# EAGLE design PDM 2021 (EAGLE 9.6.2)
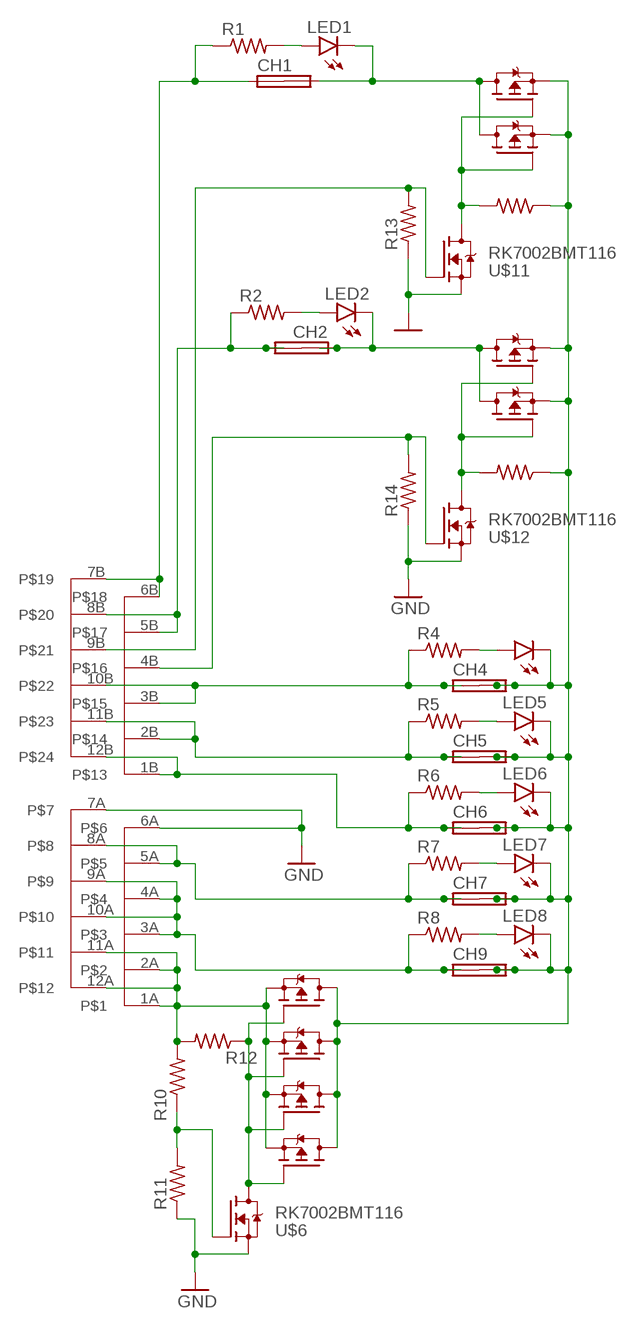
[diagram p0: schematic, sheet 1]

## Parts
CH1  3568FUSEHOLDER  [3568]
CH2  3568FUSEHOLDER  [3568]
CH4  3568FUSEHOLDER  [3568]
CH5  3568FUSEHOLDER  [3568]
CH6  3568FUSEHOLDER  [3568]
CH7  3568FUSEHOLDER  [3568]
CH9  3568FUSEHOLDER  [3568]
LED1  LEDCHIP-LED0805  [CHIP-LED0805]
LED2  LEDCHIP-LED0805  [CHIP-LED0805]
LED4  LEDCHIP-LED0805  [CHIP-LED0805]
LED5  LEDCHIP-LED0805  [CHIP-LED0805]
LED6  LEDCHIP-LED0805  [CHIP-LED0805]
LED7  LEDCHIP-LED0805  [CHIP-LED0805]
LED8  LEDCHIP-LED0805  [CHIP-LED0805]
R1  R-US_R0805  [R0805]
R2  R-US_R0805  [R0805]
R4  R-US_R0805  [R0805]
R5  R-US_R0805  [R0805]
R6  R-US_R0805  [R0805]
R7  R-US_R0805  [R0805]
R8  R-US_R0805  [R0805]
R10  R-US_R0805  [R0805]
R11  R-US_R0805  [R0805]
R12  R-US_R0805  [R0805]
R13  R-US_R0805  [R0805]
R14  R-US_R0805  [R0805]
R15  R-US_R0805  [R0805]
R16  R-US_R0805  [R0805]
U$1  _CUSTOM_111_CUSTOM_SQJ407EP-T1_GE3  [_CUSTOM_111_CUSTOM_TRANS_SIRA90DP-T1-GE3]
U$2  _CUSTOM_111_CUSTOM_SQJ407EP-T1_GE3  [_CUSTOM_111_CUSTOM_TRANS_SIRA90DP-T1-GE3]
U$3  _CUSTOM_111_CUSTOM_SQJ407EP-T1_GE3  [_CUSTOM_111_CUSTOM_TRANS_SIRA90DP-T1-GE3]
U$4  DTM1312PA12BR008  [DE_12X2_PIN_HEADER]
U$5  _CUSTOM_111_CUSTOM_SQJ407EP-T1_GE3  [_CUSTOM_111_CUSTOM_TRANS_SIRA90DP-T1-GE3]
U$6  RK7002BMT116  [SOT23]
U$7  _CUSTOM_111_CUSTOM_SQJ407EP-T1_GE3  [_CUSTOM_111_CUSTOM_TRANS_SIRA90DP-T1-GE3]
U$8  _CUSTOM_111_CUSTOM_SQJ407EP-T1_GE3  [_CUSTOM_111_CUSTOM_TRANS_SIRA90DP-T1-GE3]
U$9  _CUSTOM_111_CUSTOM_SQJ407EP-T1_GE3  [_CUSTOM_111_CUSTOM_TRANS_SIRA90DP-T1-GE3]
U$10  _CUSTOM_111_CUSTOM_SQJ407EP-T1_GE3  [_CUSTOM_111_CUSTOM_TRANS_SIRA90DP-T1-GE3]
U$11  RK7002BMT116  [SOT23]
U$12  RK7002BMT116  [SOT23]

## Nets
CH2: CH2.L1(1A) CH2.L2(1B) R2.1 U$4.5B U$4.8B
CH4: CH4.L1(1A) CH4.L2(1B) R4.1 U$4.3B U$4.10B
CH5: CH5.L1(1A) CH5.L2(1B) R5.1 U$4.2B U$4.11B
CH6: CH6.L1(1A) CH6.L2(1B) R6.1 U$4.1B U$4.12B
CH8: CH7.L1(1A) CH7.L2(1B) R7.1 U$4.5A U$4.8A
CH10: CH9.L1(1A) CH9.L2(1B) R8.1 U$4.3A U$4.4A U$4.9A U$4.10A
CH11: CH2.R1(2A) CH2.R2(2B) LED2.C U$9.5(D) U$10.5(D)
GND: R11.1 R13.1 R14.1 U$4.6A U$4.7A U$6.2(S) U$11.2(S) U$12.2(S)
N$1: CH4.R1(2A) CH4.R2(2B) CH5.R1(2A) CH5.R2(2B) CH6.R1(2A) CH6.R2(2B) CH7.R1(2A) CH7.R2(2B) CH9.R1(2A) CH9.R2(2B) LED4.C LED5.C LED6.C LED7.C LED8.C R15.1 R16.1 U$1.5(D) U$2.5(D) U$3.5(D) U$5.5(D) U$7.1(S) U$7.2(S) U$7.3(S) U$8.1(S) U$8.2(S) U$8.3(S) U$9.1(S) U$9.2(S) U$9.3(S) U$10.1(S) U$10.2(S) U$10.3(S)
N$2: LED8.A R8.2
N$3: LED7.A R7.2
N$4: LED6.A R6.2
N$5: LED5.A R5.2
N$6: LED4.A R4.2
N$7: CH1.L1(1A) R1.1 U$4.6B U$4.7B
N$8: LED2.A R2.2
N$9: CH1.R1(2A) LED1.C U$7.5(D) U$8.5(D)
N$10: R10.1 R11.2 U$6.1(G)
N$11: R12.1 U$1.4(G) U$2.4(G) U$3.4(G) U$5.4(G) U$6.3(D)
N$13: R16.2 U$7.4(G) U$8.4(G) U$11.3(D)
N$14: R13.2 U$4.9B U$11.1(G)
N$16: R10.2 R12.2 U$1.1(S) U$1.2(S) U$1.3(S) U$2.1(S) U$2.2(S) U$2.3(S) U$3.1(S) U$3.2(S) U$3.3(S) U$4.1A U$4.2A U$4.11A U$4.12A U$5.1(S) U$5.2(S) U$5.3(S)
N$17: R15.2 U$9.4(G) U$10.4(G) U$12.3(D)
N$18: LED1.A R1.2
N$19: R14.2 U$4.4B U$12.1(G)
Unconnected: CH1.L2(1B) CH1.R2(2B)

## Library data of the parts
CH1 CH2 CH4-CH7 CH9 = ACC-MB-R0:3568FUSEHOLDER: 3568 20AMP 500VAC
LED1 LED2 LED4-LED8 = led:LED: LED OSRAM: - CHIPLED LG R971, LG N971, LY N971, LG Q971, LY Q971, LO R971, LY R971 LH N974, LH R974 LS Q976, LO Q976, LY Q976 LO Q996 - Hyper CHIPLED LW Q18S LB Q993, LB Q99A, LB R99A - SideLED LS A670, LO A670, LY A670, LG A670, LP A670 LB A673, LV A673, LT A673, LW A673 LH A674 LY A675 LS A676, LA A676, LO A676, LY A676, LW A676 LS A679, LY A679, LG A679 - Hyper Micro SIDELED® LS Y876, LA Y876, LO Y876, LY Y876 LT Y87S - SmartLED LW L88C, LW L88S LB L89C, LB L89S, LG L890 LS L89K, LO L89K, LY L89K LS L896, LA L896, LO L896, LY L896 - TOPLED LS T670, LO T670, LY T670, LG T670, LP T670 LSG T670, LSP T670, LSY T670, LOP T670, LYG T670 LG T671, LOG T671, LSG T671 LB T673, LV T673, LT T673, LW T673 LH T674 LS T676, LA T676, LO T676, LY T676, LB T676, LH T676, LSB T676, LW T676 LB T67C, LV T67C, LT T67C, LS T67K, LO T67K, LY T67K, LW E67C LS E67B, LA E67B, LO E67B, LY E67B, LB E67C, LV E67C, LT E67C LW T67C LS T679, LY T679, LG T679 LS T770, LO T770, LY T770, LG T770, LP T770 LB T773, LV T773, LT T773, LW T773 LH T774 LS E675, LA E675, LY E675, LS T675 LS T776, LA T776, LO T776, LY T776, LB T776 LHGB T686 LT T68C, LB T68C - Hyper Mini TOPLED® LB M676 - Mini TOPLED Santana® LG M470 LS M47K, LO M47K, LY M47K Source: http://www.osram.convergy.de LUXEON: - LUMILED® LXK2-PW12-R00, LXK2-PW12-S00, LXK2-PW14-U00, LXK2-PW14-V00 LXK2-PM12-R00, LXK2-PM12-S00, LXK2-PM14-U00 LXK2-PE12-Q00, LXK2-PE12-R00, LXK2-PE12-S00, LXK2-PE14-T00, LXK2-PE14-U00 LXK2-PB12-K00, LXK2-PB12-L00, LXK2-PB12-M00, LXK2-PB14-N00, LXK2-PB14-P00, LXK2-PB14-Q00 LXK2-PR12-L00, LXK2-PR12-M00, LXK2-PR14-Q00, LXK2-PR14-R00 LXK2-PD12-Q00, LXK2-PD12-R00, LXK2-PD12-S00 LXK2-PH12-R00, LXK2-PH12-S00 LXK2-PL12-P00, LXK2-PL12-Q00, LXK2-PL12-R00 Source: www.luxeon.com KINGBRIGHT: KA-3528ASYC Source: www.kingbright.com
R1 R2 R4-R8 R10-R16 = rcl:R-US_: RESISTOR, American symbol; SPICEPREFIX: R
U$1-U$3 U$5 U$7-U$10 = ACC-MB-R0:_CUSTOM_111_CUSTOM_SQJ407EP-T1_GE3
U$4 = CUSTOM_PARTS:DTM1312PA12BR008
U$6 U$11 U$12 = ACC-MB-R0:RK7002BMT116

## Net classes
0 default: width 0.3 mm, drill 0.3 mm, clearance 0.3 mm

## Board
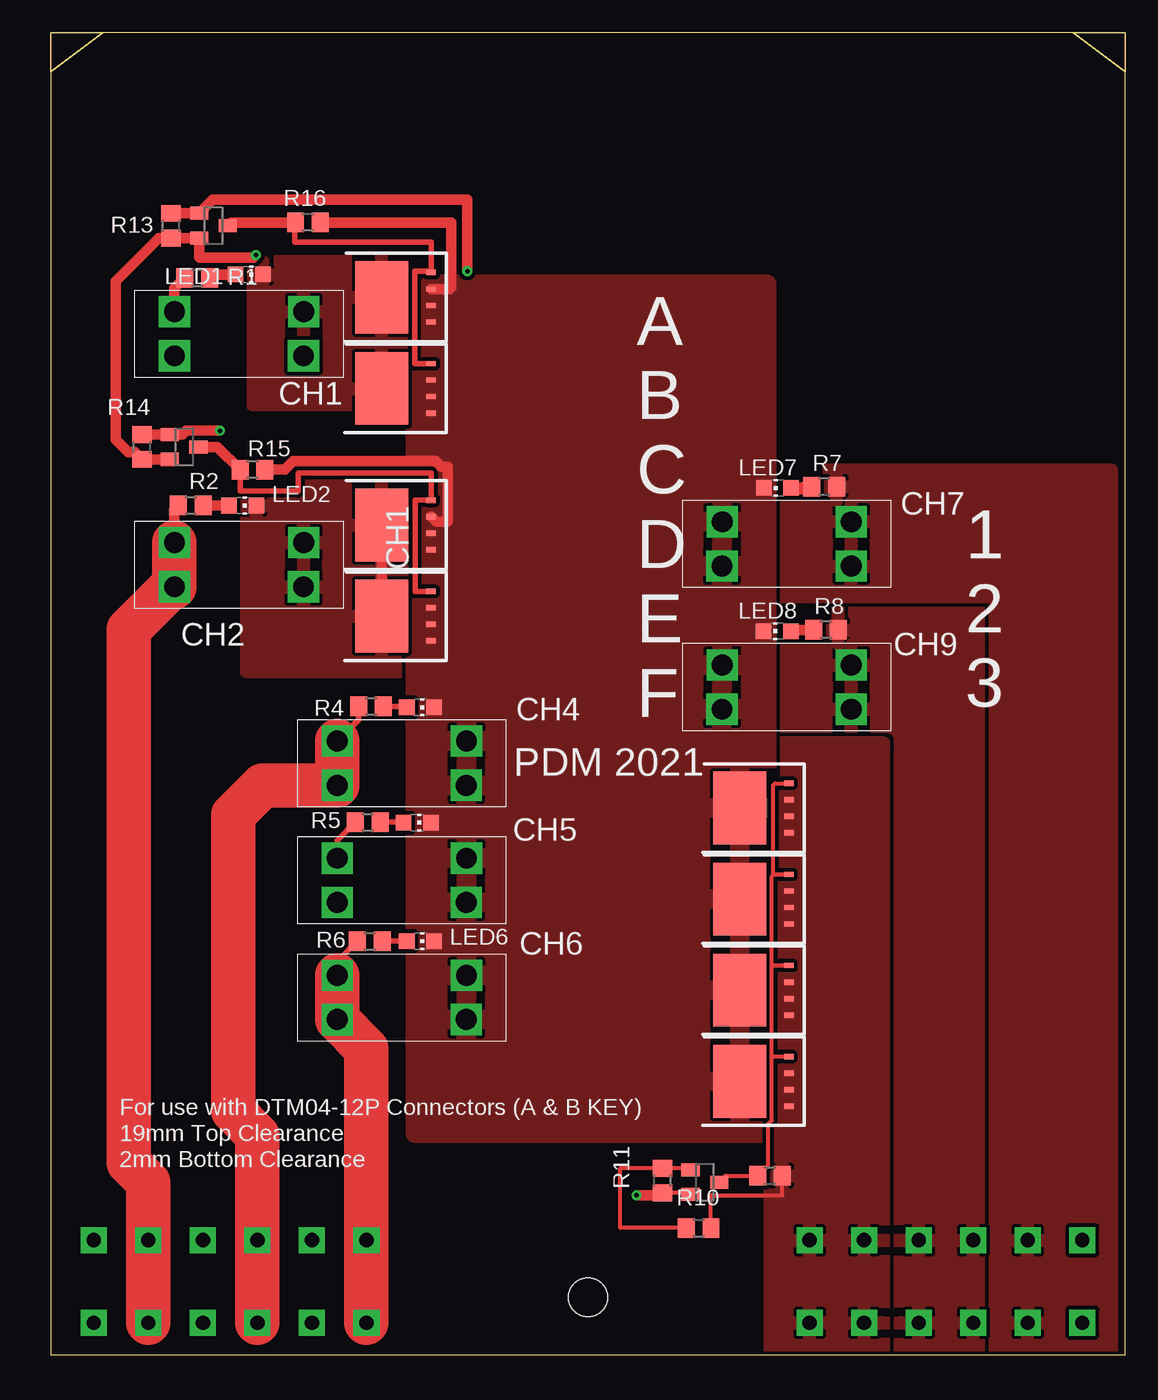
[diagram p1: board, top side]
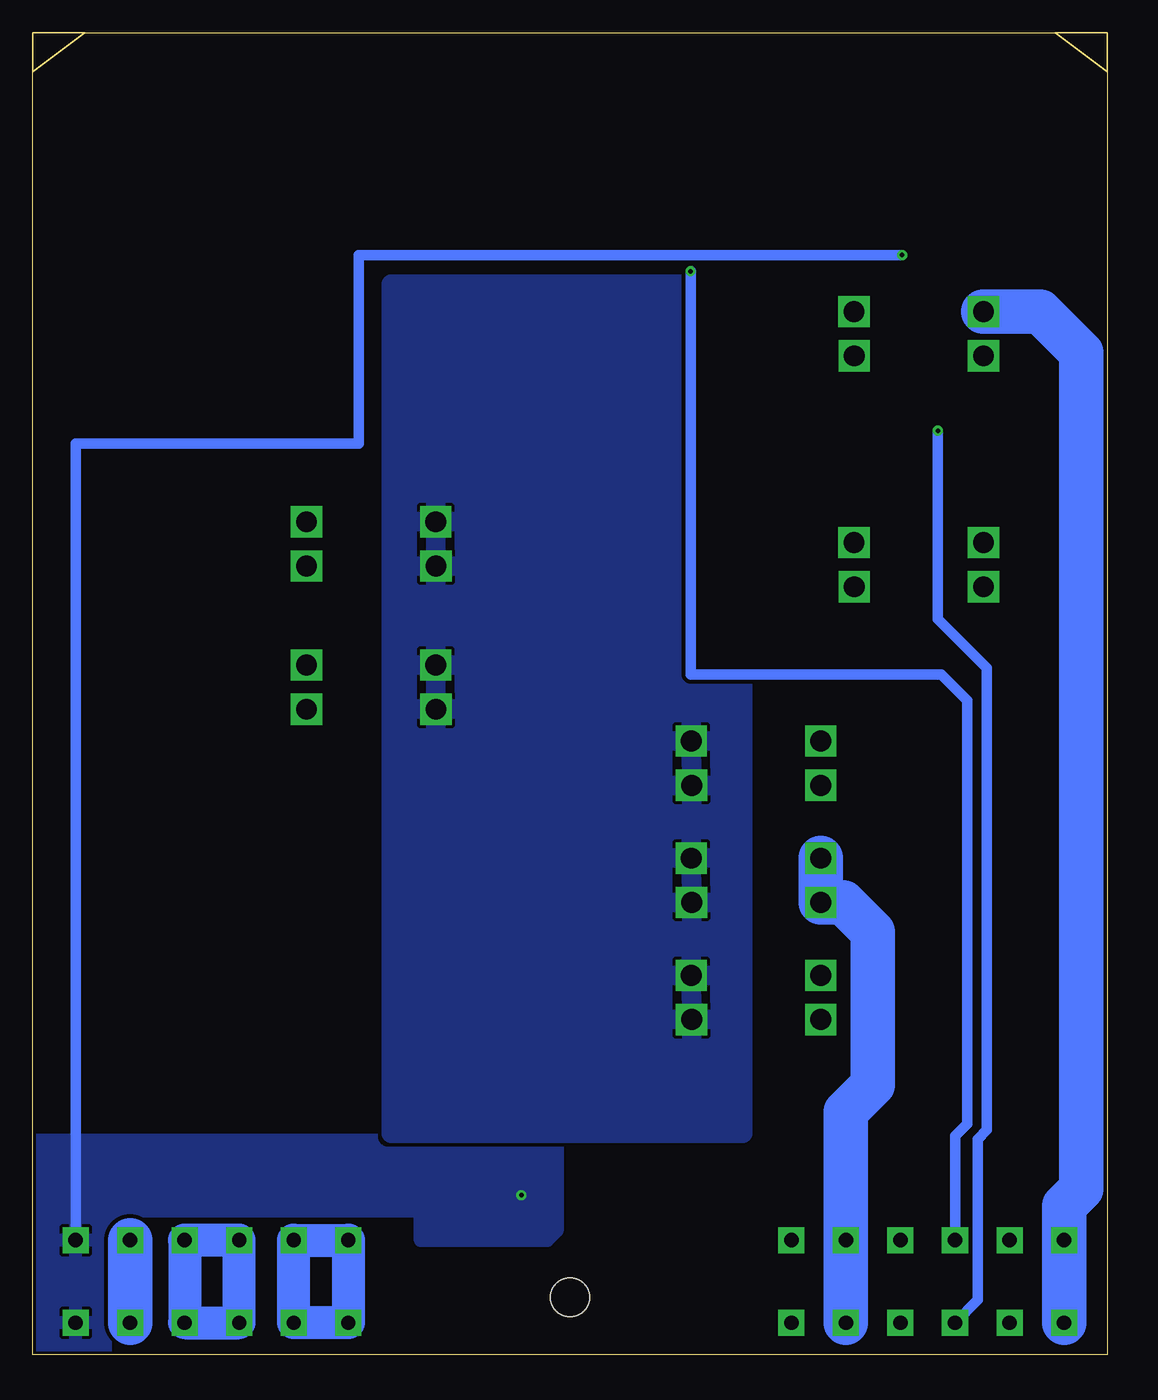
[diagram p2: board, bottom side, seen from below]

Size 82.55 x 101.6 mm. Coordinates in mm from the lower left corner, seen from the top.
Outline: 0,0 82.55,0 82.55,101.6 0,101.6 0,0
Copper layers (1*16): Top 0.035mm / dielectric 1.5mm / Bottom 0.035mm
Design rules "default *": minimum track width 6mil, minimum drill 0.35mm, track to track 6mil, track to pad 6mil, pad to pad 6mil, via to via 6mil, smd to smd 0mil, copper to edge 10mil, drill to drill 6mil, minimum pad ring 10mil, minimum via ring 8mil, stop-mask expansion 4mil, vias tented up to drill 0mil, thermal gap 10mil
Milling: area 0,98.6 to 4,101.6; area 78.5,98.6 to 82.5,101.6

### Footprints (pad centres in the part's own frame; a part is rotated, then mirrored left to right if it is on the bottom)
3568 = drill 1.6 square: L1 0,3.4; L2 0,0; R1 9.94,3.4; R2 9.92,0
CHIP-LED0805 = smd 1.2 x 1.2: A 0,-1.05; C 0,1.05
R0805 = smd 1.3 x 1.5: 1 -0.95,0; 2 0.95,0
_CUSTOM_111_CUSTOM_TRANS_SIRA90DP-T1-GE3 = smd 0.41 x 0.72: 1 -1.905,-2.715; 2 -0.635,-2.715; 3 0.635,-2.715; 4 1.905,-2.715 | smd 5.588 x 4.064: 5 0,1.08
DE_12X2_PIN_HEADER = drill 1.1 pad 2 square: 1A 17.02,4.39; 1B -17.02,-1.96; 2A 21.21,4.39; 2B -21.21,-1.96; 3A 25.4,4.39; 3B -25.4,-1.96; 4A 29.59,4.39; 4B -29.59,-1.96; 5A 33.78,4.39; 5B -33.78,-1.96; 6A 37.97,4.39; 6B -37.97,-1.96; 7A 37.97,-1.96; 7B -37.97,4.39; 8A 33.78,-1.96; 8B -33.78,4.39; 9A 29.59,-1.96; 9B -29.59,4.39; 10A 25.4,-1.96; 10B -25.4,4.39; 11A 21.21,-1.96; 11B -21.21,4.39; 12A 17.02,-1.96; 12B -17.02,4.39 | hole 3: 0,0
SOT23 = smd 1 x 1.4: 1 -0.95,-1.1; 2 0.95,-1.1; 3 0,1.1

### Placement (x,y rotation side)
CH1  9.5,76.75 0 top
CH2  9.5,59 0 top
CH4  22,43.75 0 top
CH5  22,34.75 0 top
CH6  22,25.75 0 top
CH7  61.5,64 180 top
CH9  61.5,53 180 top
LED1  15.25,83 270 top
LED2  14.75,65.25 270 top
LED4  28.4,49.74 270 top
LED5  28.15,40.88 270 top
LED6  28.4,31.77 270 top
LED7  55.83,66.6 90 top
LED8  55.81,55.6 90 top
R1  11.25,82.75 0 top
R2  10.75,65.25 0 top
R4  24.6,49.82 0 top
R5  24.35,40.93 0 top
R6  24.5,31.78 0 top
R7  59.42,66.7 180 top
R8  59.56,55.7 180 top
R10  49.77,9.73 0 top
R11  46.98,13.37 90 top
R12  55.25,13.75 0 top
R13  9.25,86.75 90 top
R14  7,69.75 90 top
R15  15.5,68 180 top
R16  19.75,87 180 top
U$1  54,28 90 top
U$2  54,35 90 top
U$3  54,21 90 top
U$4  41.27,4.41 0 top
U$5  54,42 90 top
U$6  50.25,13.25 270 top
U$7  26.5,74.25 90 top
U$8  26.5,81.25 90 top
U$9  26.5,63.75 90 top
U$10  26.5,56.75 90 top
U$11  12.5,86.75 270 top
U$12  10.25,69.75 270 top

### Tracks (layer width: path | path; a pad name or v marks a point on that pad's centre or on a via)
CH2
  Top 0.813: CH2.L1 9.5,64.95 R2.1
  Top 3.4: U$4.5B U$4.8B 7.5,13.23 6,14.73 6,55.73 9.27,59 CH2.L2 CH2.L1
CH4
  Top 0.406: CH4.L1 23.65,48.8 R4.1
  Top 3.4: U$4.3B U$4.10B 15.88,16.86 14,18.73 14,41.48 16.27,43.75 CH4.L2 CH4.L1
CH5
  Top 0.406: CH5.L1 22,39.53 R5.1
  Bottom 3.4: U$4.2B U$4.11B 20.07,18.66 18,20.73 18,32.48 20.27,34.75 CH5.L2 CH5.L1
CH6
  Top 0.406: CH6.L1 22,30.23 R6.1
  Top 3.4: U$4.1B U$4.12B 24.25,23.5 CH6.L2 CH6.L1
CH8
  Bottom 3.4: U$4.8A U$4.5A
  pour Top (rank 2): 55.25,67.99 55.25,58.75 55.75,58.25 72.5,58.25 72.5,-2.5 81.5,-2.5 81.5,67.99
CH10
  Bottom 2.54: U$4.3A U$4.4A U$4.9A U$4.10A U$4.3A
  pour Top (rank 3): 55.5,57.75 55.5,47.5 65.25,47.5 64.25,-2.5 72.75,-2.5 71.75,57.75
CH11
  Top 0.813: U$9.5 U$10.5
  pour Top (rank 2): 15,67.75 15,52.5 31,52.5 31,67.75
GND  (via drill 0.35)
  Top 0.3: U$6.2 49.03,12.42 R11.1
  Top 0.813: R11.1 46.81,12.25 v45,12.25 | U$12.2 R14.1 6.46,69.34 5.96,69.34 5,70.3 5,82.5 8.3,85.8 R13.1 U$11.2 11.4,84.35 11.44,84.31 15.56,84.31 v15.75,84.5
  Bottom 0.813: v15.75,84.5 57.5,84.5 57.5,70 79.25,70 U$4.6A
  pour Bottom (rank 2): 42.25,16.5 42.25,9.5 43,8.75 52.75,8.75 52.75,11 76.5,11 76.5,-2.5 82.75,-2.5 82.75,16.5
N$1
  Top 0.813: U$8.3 30.64,81.89 30.75,82 30.75,87 R16.1 | R15.1 17.96,68 18.62,68.66 29.59,68.66 30,68.25 30.5,68.25 30.5,64 29.6,64 U$9.3
  pour Top: 28,82.25 28,17 55,17 55,82.25
  pour Bottom: 28,82.25 28,17 55,17 55,82.25
N$2
  Top 0.813: LED8.A 56.96,55.7 R8.2
N$3
  Top 0.813: 57.79,66.56 R7.2
  Top 1: LED7.A 57.79,66.56
N$4
  Top 0.406: R6.2 LED6.A
N$5
  Top 0.406: R5.2 27.05,40.93 LED5.A
N$6
  Top 0.406: R4.2 27.27,49.82 LED4.A
N$7
  Top 0.813: CH1.L1 9.5,81.95 R1.1
  Bottom 3.4: U$4.6B U$4.7B 3.31,11.43 2,12.73 2,77 5.15,80.15 CH1.L1
N$8
  Top 0.813: R2.2 LED2.A
N$9
  pour Top (rank 2): 15.5,84 15.5,73 31,73 31,84
N$10
  Top 0.3: U$6.1 49.03,14.32 R11.2 43.75,14.32 43.75,9.75 43.77,9.73 R10.1
N$11
  Top 0.3: U$6.3 51.85,13.75 R12.1 55.1,14.55 55.1,17.72 55.4,18.02 55.4,22.84 | U$3.4 55.47,22.91 55.4,22.84 | 55.4,22.84 55.4,29.75 | 55.4,29.75 55.56,29.91 U$1.4 55.4,29.91 | 55.4,29.75 55.4,29.91 | 55.4,29.91 55.4,36.75 55.56,36.91 U$2.4 55.5,36.91 55.5,43.75 55.66,43.91 U$5.4
N$13
  Top 0.406: U$7.4 27.95,76.16 27.95,83.25 29.12,83.25 U$8.4 29.21,85.5 18.75,85.5 18.75,86.95
  Top 0.813: U$11.3 13.85,87 R16.2 18.75,86.95
N$14  (via drill 0.35)
  Top 0.813: R13.2 U$11.1 12.45,88.75 32,88.75 v32,83.25
  Bottom 0.813: U$4.9B 11.69,16.82 10.75,17.75 10.75,50.25 12.75,52.25 32,52.25 v32,83.25
N$16
  Top 0.3: R10.2 50.72,12.23 50.74,12.25 56.2,12.25 R12.2
  Bottom 2.54: U$4.1A U$4.12A U$4.11A U$4.2A U$4.1A
  pour Top (rank 2): 55.25,47 55.25,-2.5 64,-2.5 64,47
N$17
  Top 0.406: U$10.4 28,58.66 28,65.66 U$9.4 29.21,67.75 19,67.75 19,66.35 14.55,66.35 R15.2
  Top 0.813: R15.2 12.8,69.75 U$12.3
N$18
  Top 0.813: R1.2 12.45,83 LED1.A
N$19  (via drill 0.35)
  Top 0.813: v13,71 10.4,71 10.1,70.7 U$12.1 R14.2
  Bottom 0.813: U$4.4B 9.94,4.2 9.94,16.55 9.23,17.26 9.23,52.75 13,56.52 v13,71

### Text on the board
tPlace: CH1 | CH1 | CH7 | CH2 | CH9 | CH4 | PDM 2021 | CH5 | CH6
tNames: 1 / 2 / 3 | A / B / C / D / E / F